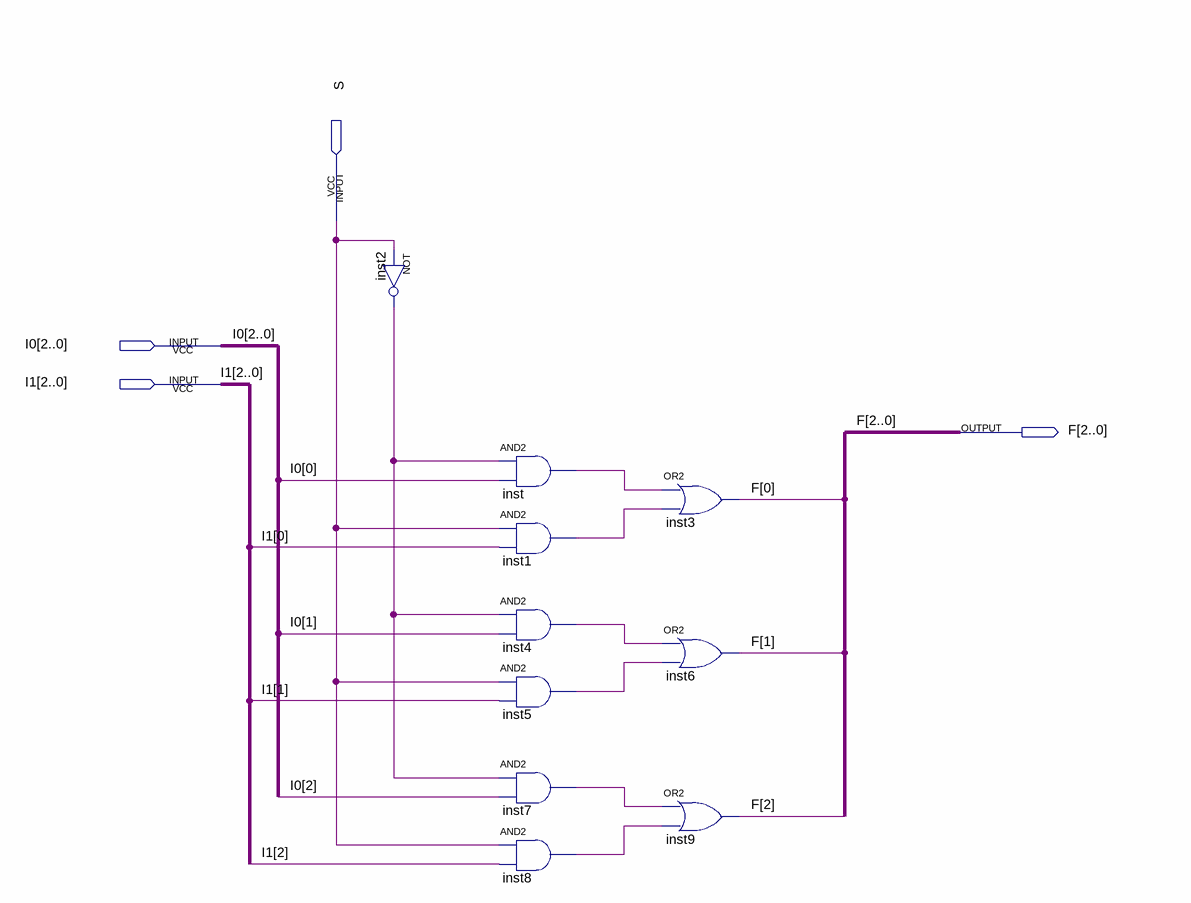
[diagram p0: schematic sheet]
// Quartus schematic 2to1_3bitMux.bdf as structural Verilog: 10 symbols, 4 pins
module \2to1_3bitMux  (
  input  S,
  input  [2:0] I0,
  input  [2:0] I1,
  output [2:0] F
);

  wire inst1_out, inst2_out, inst4_out, inst5_out, inst7_out, inst8_out, inst_out;

  not inst2 (inst2_out, S);
  and inst (inst_out, inst2_out, I0[0]);
  and inst1 (inst1_out, S, I1[0]);
  and inst4 (inst4_out, inst2_out, I0[1]);
  and inst5 (inst5_out, S, I1[1]);
  and inst7 (inst7_out, inst2_out, I0[2]);
  and inst8 (inst8_out, S, I1[2]);
  or inst3 (F[0], inst_out, inst1_out);
  or inst6 (F[1], inst4_out, inst5_out);
  or inst9 (F[2], inst7_out, inst8_out);
endmodule
